# EAGLE schematic traffic control (EAGLE 9.7.0)
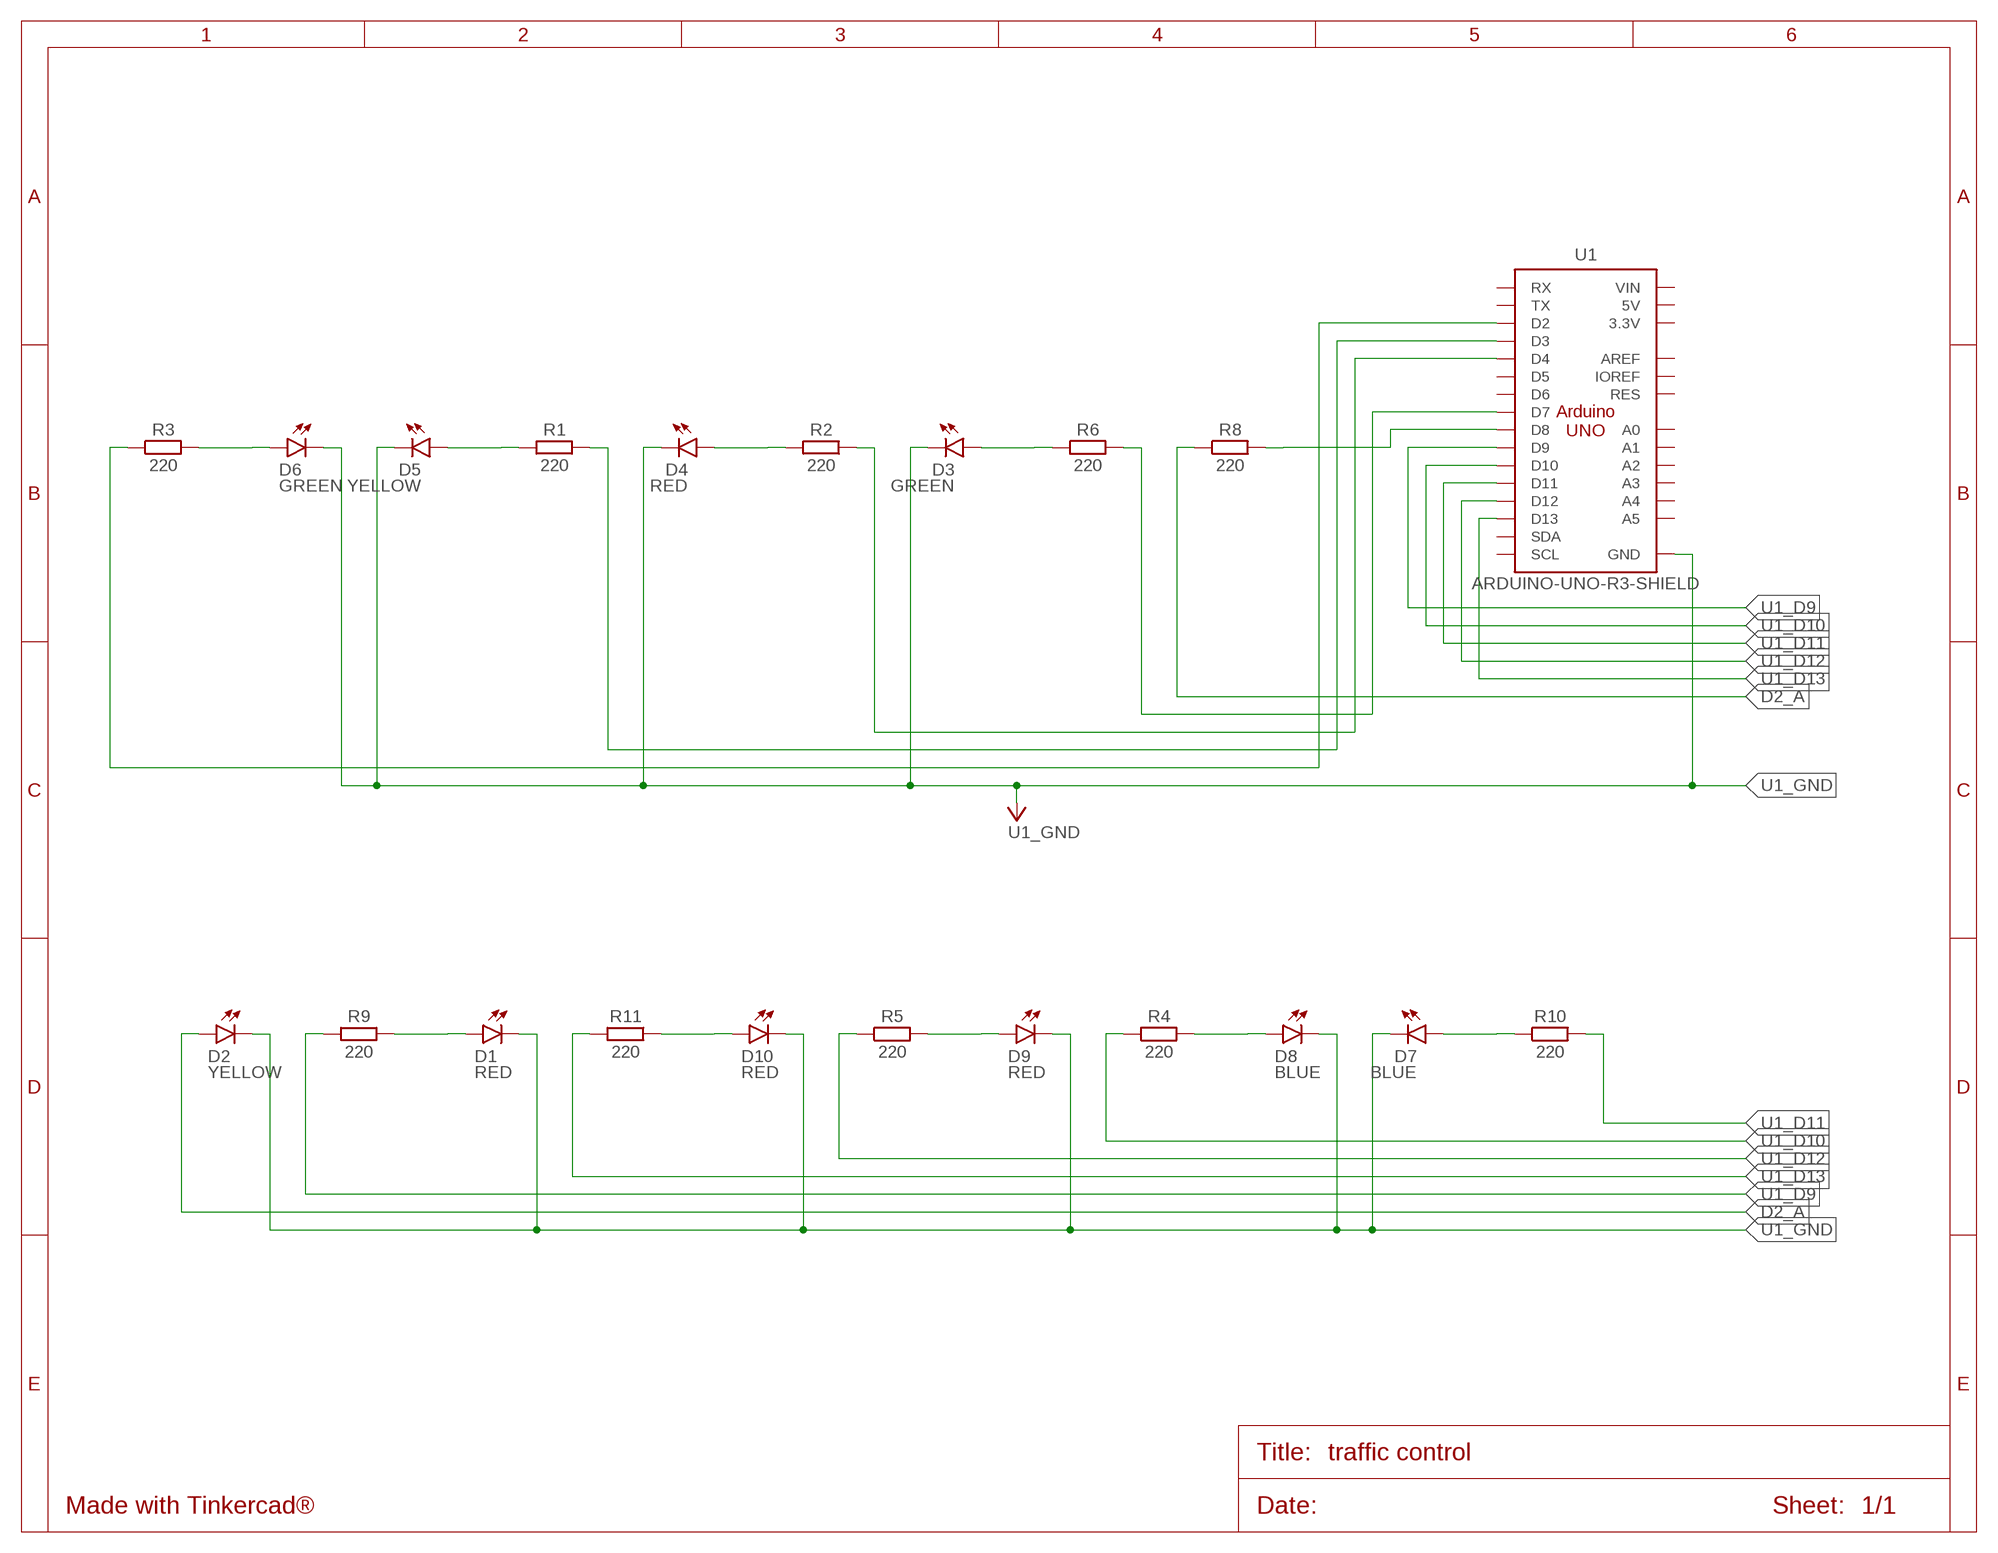
[diagram p0: schematic, sheet 1]

## Parts
D1  RED  LED_RADIAL_RED  [LEDRD254W60D565H860B]
D2  YELLOW  LED_RADIAL_YELLOW  [LEDRD254W60D565H860B_Y]
D3  GREEN  LED_RADIAL_GREEN  [LEDRD254W60D565H860B_G]
D4  RED  LED_RADIAL_RED  [LEDRD254W60D565H860B]
D5  YELLOW  LED_RADIAL_YELLOW  [LEDRD254W60D565H860B_Y]
D6  GREEN  LED_RADIAL_GREEN  [LEDRD254W60D565H860B_G]
D7  BLUE  LED_RADIAL_BLUE  [LEDRD254W60D565H860B_B]
D8  BLUE  LED_RADIAL_BLUE  [LEDRD254W60D565H860B_B]
D9  RED  LED_RADIAL_RED  [LEDRD254W60D565H860B]
D10  RED  LED_RADIAL_RED  [LEDRD254W60D565H860B]
R1  220  RESISTOR_AXIAL-10.16MM-PITCH  [RESAD1016W63L850D250B]
R2  220  RESISTOR_AXIAL-10.16MM-PITCH  [RESAD1016W63L850D250B]
R3  220  RESISTOR_AXIAL-10.16MM-PITCH  [RESAD1016W63L850D250B]
R4  220  RESISTOR_AXIAL-10.16MM-PITCH  [RESAD1016W63L850D250B]
R5  220  RESISTOR_AXIAL-10.16MM-PITCH  [RESAD1016W63L850D250B]
R6  220  RESISTOR_AXIAL-10.16MM-PITCH  [RESAD1016W63L850D250B]
R8  220  RESISTOR_AXIAL-10.16MM-PITCH  [RESAD1016W63L850D250B]
R9  220  RESISTOR_AXIAL-10.16MM-PITCH  [RESAD1016W63L850D250B]
R10  220  RESISTOR_AXIAL-10.16MM-PITCH  [RESAD1016W63L850D250B]
R11  220  RESISTOR_AXIAL-10.16MM-PITCH  [RESAD1016W63L850D250B]
U1  ARDUINO-UNO-R3-SHIELD  [ARDUINO-UNO-R3-SHIELD]

## Nets
D1_A: D1.1(A) R9.1
D2_A: D2.1(A) R8.1
D3_A: D3.1(A) R6.1
D4_A: D4.1(A) R2.2
D5_A: D5.1(A) R1.2
D6_A: D6.1(A) R3.2
D7_A: D7.1(A) R10.1
D8_A: D8.1(A) R4.2
D9_A: D9.1(A) R5.2
D10_A: D10.1(A) R11.1
U1_D2: R3.1 U1.D2
U1_D3: R1.1 U1.D3
U1_D4: R2.1 U1.D4
U1_D7: R6.2 U1.D7
U1_D8: R8.2 U1.D8
U1_D9: R9.2 U1.D9
U1_D10: R4.1 U1.D10
U1_D11: R10.2 U1.D11
U1_D12: R5.1 U1.D12
U1_D13: R11.2 U1.D13
U1_GND: D1.2(C) D2.2(C) D3.2(C) D4.2(C) D5.2(C) D6.2(C) D7.2(C) D8.2(C) D9.2(C) D10.2(C) U1.GND@0(GND) U1.GND@1(GND) U1.GND@2(GND)
Unconnected: U1.3.3V U1.5V U1.A0 U1.A1 U1.A2 U1.A3 U1.A4 U1.A5 U1.AREF U1.D5 U1.D6 U1.IOREF U1.RES U1.RX U1.SCL U1.SDA U1.TX U1.VIN

## Library data of the parts
D1 D4 D9 D10 = Tinkercad:LED_RADIAL: LED - Generic; CATEGORY: Opto-Electronic; SUB-CATEGORY: LED; VALUE: LED_RED
D2 D5 = Tinkercad:LED_RADIAL: LED - Generic; CATEGORY: Opto-Electronic; SUB-CATEGORY: LED; VALUE: LED_YELLOW
D3 D6 = Tinkercad:LED_RADIAL: LED - Generic; CATEGORY: Opto-Electronic; SUB-CATEGORY: LED; VALUE: LED_GREEN
D7 D8 = Tinkercad:LED_RADIAL: LED - Generic; CATEGORY: Opto-Electronic; SUB-CATEGORY: LED; VALUE: LED_BLUE
R1-R6 R8-R11 = Tinkercad:RESISTOR: Resistor Fixed - Generic
U1 = Tinkercad:ARDUINO-UNO-R3-SHIELD